# EAGLE design TG-16 (EAGLE 9.6.2)
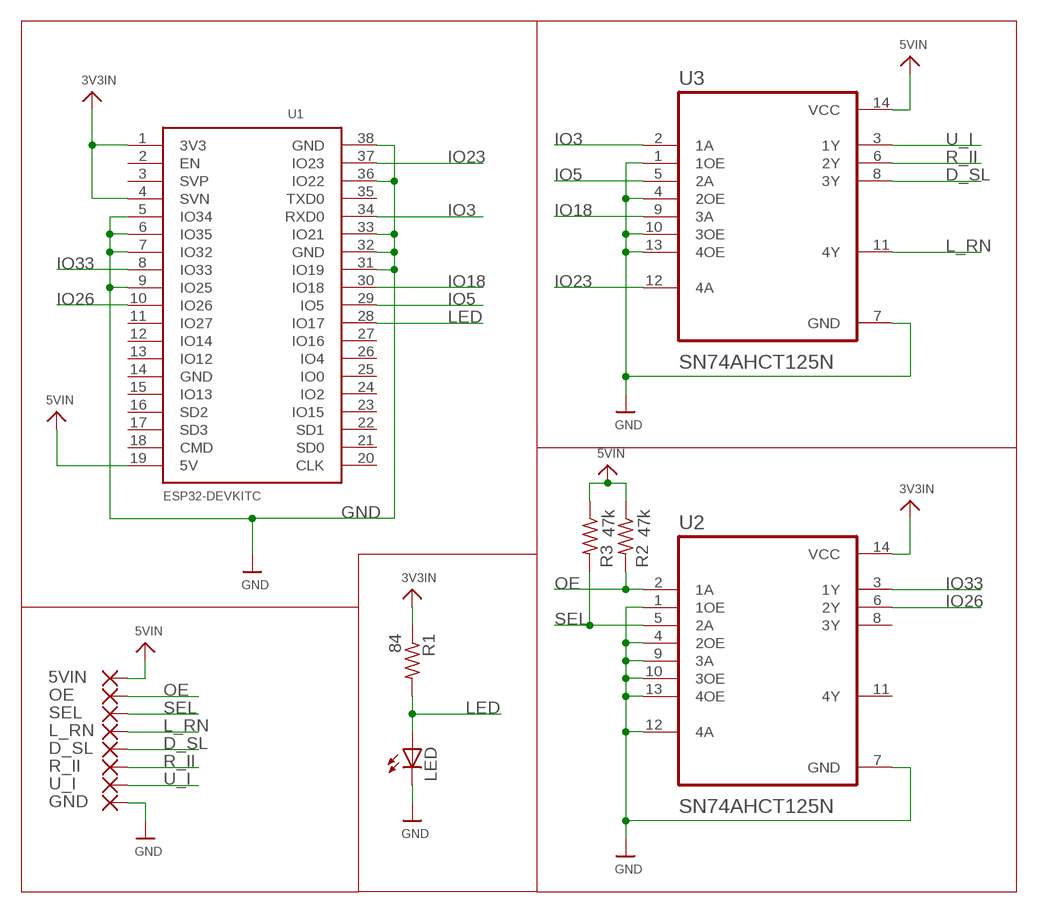
[diagram p0: schematic, sheet 1]

## Parts
5VIN  SMD5  [SMD2,54-5,08]
D_SL  SMD5  [SMD2,54-5,08]
GND  SMD5  [SMD2,54-5,08]
L_RN  SMD5  [SMD2,54-5,08]
LED  LEDCHIPLED_1206  [CHIPLED_1206]
OE  SMD5  [SMD2,54-5,08]
R1  84  R-US_R1206  [R1206]
R2  47k  R-US_R1206  [R1206]
R3  47k  R-US_R1206  [R1206]
R_II  SMD5  [SMD2,54-5,08]
SEL  SMD5  [SMD2,54-5,08]
U1  ESP32DEVKITC  [ESP32-DEVKITC]
U2  SN74AHCT125N  [DIP794W45P254L1969H508Q14]
U3  SN74AHCT125N  [DIP794W45P254L1969H508Q14]
U_I  SMD5  [SMD2,54-5,08]

## Nets
3V3IN: R1.1 U1.1(3V3) U1.4(SVN) U2.14(VCC)
5VIN: 5VIN.1(P) R2.1 R3.1 U1.19(5V) U3.14(VCC)
D_SL: D_SL.1(P) U3.8(3Y)
GND: GND.1(P) LED.C U1.5(IO34) U1.6(IO35) U1.7(IO32) U1.9(IO25) U1.31(IO19) U1.32(GND) U1.33(IO21) U1.36(IO22) U1.38(GND) U2.1(1OE) U2.4(2OE) U2.7(GND) U2.9(3A) U2.10(3OE) U2.12(4A) U2.13(4OE) U3.1(1OE) U3.4(2OE) U3.7(GND) U3.10(3OE) U3.13(4OE)
IO3: U1.34(RXD0) U3.2(1A)
IO5: U1.29(IO5) U3.5(2A)
IO18: U1.30(IO18) U3.9(3A)
IO23: U1.37(IO23) U3.12(4A)
IO26: U1.10(IO26) U2.6(2Y)
IO33: U1.8(IO33) U2.3(1Y)
L_RN: L_RN.1(P) U3.11(4Y)
LED: LED.A R1.2 U1.28(IO17)
OE: OE.1(P) R2.2 U2.2(1A)
R_II: R_II.1(P) U3.6(2Y)
SEL: R3.2 SEL.1(P) U2.5(2A)
U_I: U3.3(1Y) U_I.1(P)
Unconnected: U1.2(EN) U1.3(SVP) U1.11(IO27) U1.12(IO14) U1.13(IO12) U1.14(GND) U1.15(IO13) U1.16(SD2) U1.17(SD3) U1.18(CMD) U1.20(CLK) U1.21(SD0) U1.22(SD1) U1.23(IO15) U1.24(IO2) U1.25(IO0) U1.26(IO4) U1.27(IO16) U1.35(TXD0) U2.8(3Y) U2.11(4Y)

## Library data of the parts
5VIN D_SL GND L_RN OE R_II SEL U_I = wirepad:SMD5: SMD PAD
LED = adafruit:LED: LED OSRAM: - CHIPLED LG R971, LG N971, LY N971, LG Q971, LY Q971, LO R971, LY R971 LH N974, LH R974 LS Q976, LO Q976, LY Q976 LO Q996 - Hyper CHIPLED LW Q18S LB Q993, LB Q99A, LB R99A - SideLED LS A670, LO A670, LY A670, LG A670, LP A670 LB A673, LV A673, LT A673, LW A673 LH A674 LY A675 LS A676, LA A676, LO A676, LY A676, LW A676 LS A679, LY A679, LG A679 - Hyper Micro SIDELED® LS Y876, LA Y876, LO Y876, LY Y876 LT Y87S - SmartLED LW L88C, LW L88S LB L89C, LB L89S, LG L890 LS L89K, LO L89K, LY L89K LS L896, LA L896, LO L896, LY L896 - TOPLED LS T670, LO T670, LY T670, LG T670, LP T670 LSG T670, LSP T670, LSY T670, LOP T670, LYG T670 LG T671, LOG T671, LSG T671 LB T673, LV T673, LT T673, LW T673 LH T674 LS T676, LA T676, LO T676, LY T676, LB T676, LH T676, LSB T676, LW T676 LB T67C, LV T67C, LT T67C, LS T67K, LO T67K, LY T67K, LW E67C LS E67B, LA E67B, LO E67B, LY E67B, LB E67C, LV E67C, LT E67C LW T67C LS T679, LY T679, LG T679 LS T770, LO T770, LY T770, LG T770, LP T770 LB T773, LV T773, LT T773, LW T773 LH T774 LS E675, LA E675, LY E675, LS T675 LS T776, LA T776, LO T776, LY T776, LB T776 LHGB T686 LT T68C, LB T68C - Hyper Mini TOPLED® LB M676 - Mini TOPLED Santana® LG M470 LS M47K, LO M47K, LY M47K Source: http://www.osram.convergy.de/
R1-R3 = adafruit:R-US_: RESISTOR, American symbol
U1 = ESP32-DEVKITC:ESP32DEVKITC
U2 U3 = SN74AHCT125N:SN74AHCT125N: None Check prices <https://pricing.snapeda.com/parts/SN74AHCT125N/Texas%20Instruments/view-part?ref=eda>; AVAILABILITY: In Stock; DESCRIPTION: Quadruple Bus Buffer Gates With 3-State Outputs 14-PDIP -40 to 125; MF: Texas Instruments; MP: SN74AHCT125N; PACKAGE: PDIP-14 Texas Instruments; PRICE: None; PURCHASE-URL: https://pricing.snapeda.com/search/part/SN74AHCT125N/?ref=eda

## Board
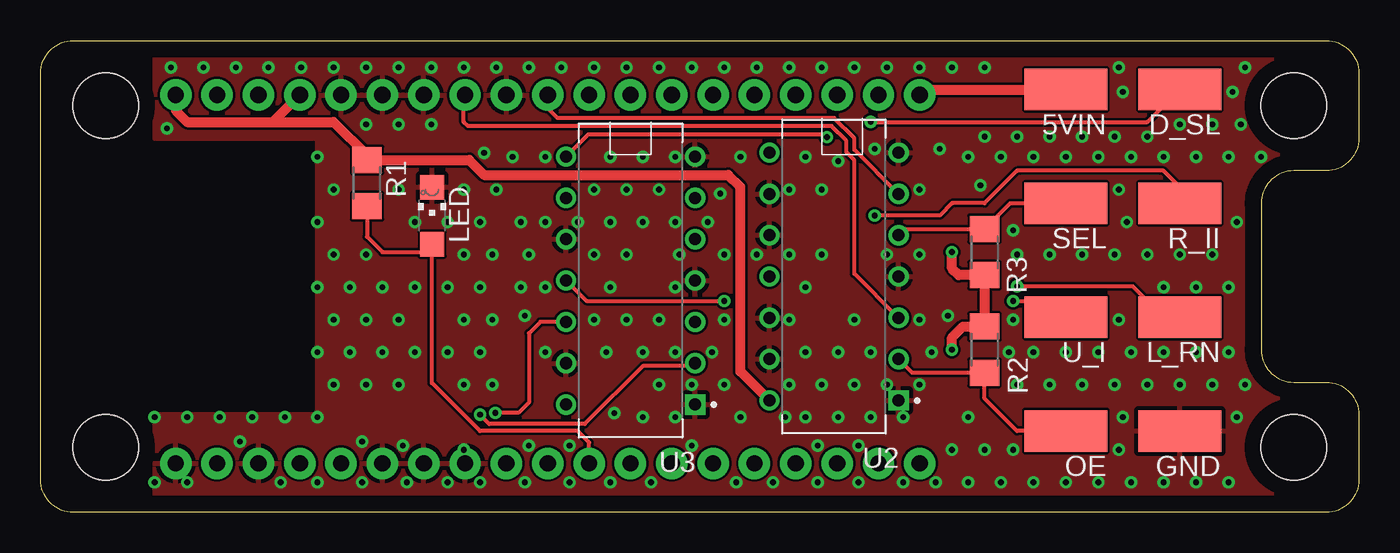
[diagram p1: board, top side]
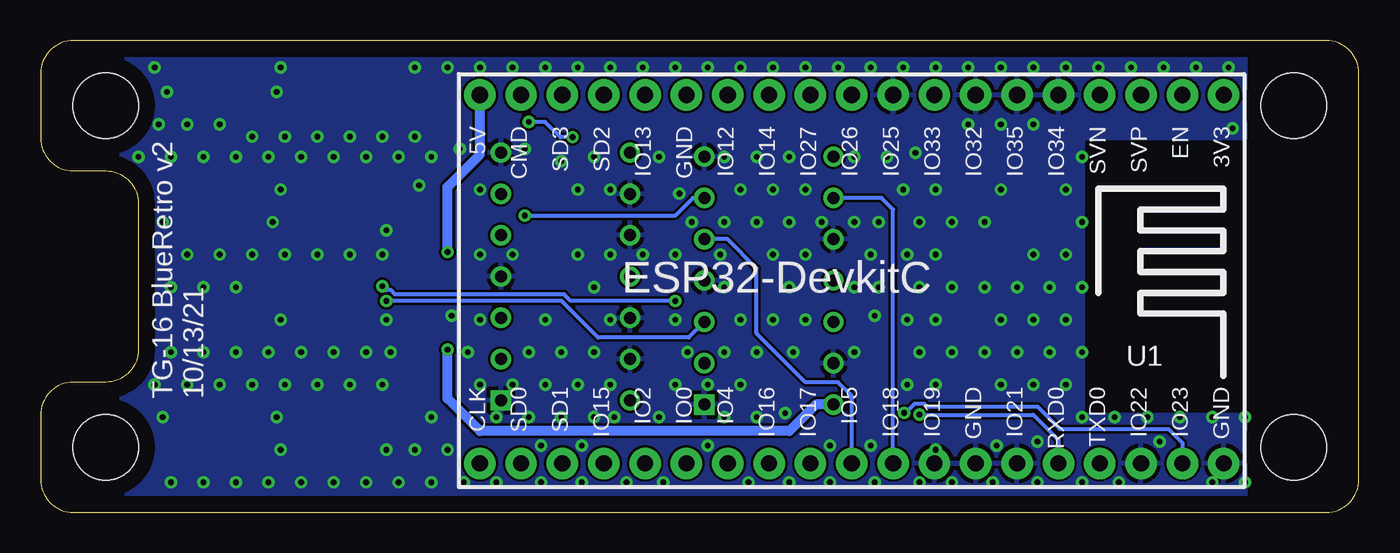
[diagram p2: board, bottom side, seen from below]

Size 81 x 29 mm. Coordinates in mm from the lower left corner, seen from the top.
Outline: 2,29 79,29 arc-90 81,27 81,23 arc-90 79,21 77,21 arc90 75,19 75,10 arc90 77,8 79,8 arc-90 81,6 81,2 arc-90 79,0 2,0 arc-90 0,2 0,27 arc-90 2,29
Copper layers (1*16): Top 0.035mm / dielectric 1.5mm / Bottom 0.035mm
Design rules "default": minimum track width 6mil, minimum drill 0.35mm, track to track 6mil, track to pad 6mil, pad to pad 6mil, via to via 6mil, smd to smd 6mil, copper to edge 40mil, drill to drill 6mil, minimum pad ring 10mil, minimum via ring 8mil, stop-mask expansion 4mil, vias tented up to drill 0.5mm, thermal gap 10mil
Holes 4 mm at 4,4 4,25 77,25 77,4

### Footprints (pad centres in the part's own frame; a part is rotated, then mirrored left to right if it is on the bottom)
SMD2,54-5,08 = smd 2.54 x 5.08: 1 0,0
CHIPLED_1206 = smd 1.5 x 1.5: A 0,-1.75; C 0,1.75
R1206 = smd 1.6 x 1.803: 1 -1.422,0; 2 1.422,0
ESP32-DEVKITC = drill 1 pad 1.93: 1 -22.87,-11.42; 2 -20.33,-11.42; 3 -17.79,-11.42; 4 -15.25,-11.42; 5 -12.71,-11.42; 6 -10.17,-11.42; 7 -7.63,-11.42; 8 -5.09,-11.42; 9 -2.55,-11.42; 10 -0.01,-11.42; 11 2.53,-11.42; 12 5.07,-11.42; 13 7.61,-11.42; 14 10.15,-11.42; 15 12.69,-11.42; 16 15.23,-11.42; 17 17.77,-11.42; 18 20.31,-11.42; 19 22.85,-11.42; 20 22.85,11.23; 21 20.31,11.23; 22 17.77,11.23; 23 15.23,11.23; 24 12.69,11.23; 25 10.15,11.23; 26 7.61,11.23; 27 5.07,11.23; 28 2.53,11.23; 29 -0.01,11.23; 30 -2.55,11.23; 31 -5.09,11.23; 32 -7.63,11.23; 33 -10.17,11.23; 34 -12.71,11.23; 35 -15.25,11.23; 36 -17.79,11.23; 37 -20.33,11.23; 38 -22.87,11.23
DIP794W45P254L1969H508Q14 = drill 0.74 pad 1.14 square: 1 -3.97,7.62 | drill 0.74 pad 1.14: 2 -3.97,5.08; 3 -3.97,2.54; 4 -3.97,0; 5 -3.97,-2.54; 6 -3.97,-5.08; 7 -3.97,-7.62; 8 3.97,-7.62; 9 3.97,-5.08; 10 3.97,-2.54; 11 3.97,0; 12 3.97,2.54; 13 3.97,5.08; 14 3.97,7.62

### Placement (x,y rotation side)
5VIN  63,26 90 top
D_SL  70,26 90 top
GND  70,5 90 top
L_RN  70,12 90 top
LED  24.05,18.24 0 top
OE  63,5 90 top
R1  20.05,20.24 270 top
R2  58,10 270 top
R3  58,16 90 top
R_II  70,19 90 top
SEL  63,19 90 top
U1  31.17,14.24 180 bottom
U2  48.75,14.5 180 top
U3  36.25,14.25 180 top
U_I  63,12 90 top

### Tracks (layer width: path | path; a pad name or v marks a point on that pad's centre or on a via)
3V3IN
  Top 0.254: 20.05,21.95 R1.1
  Top 0.61: U1.1 8.3,24.7 9,24 14.26,24 | U1.4 14.26,24 | 14.26,24 18,24 20.05,21.95 | U2.14 43,8.66 43,20 42.25,20.75 27.25,20.75 26.34,21.66 R1.1
5VIN  (via drill 0.35)
  Top 0.61: U1.19 54.36,26 5VIN.1 | v56,10 56,10.75 56.67,11.42 R2.1 R3.1 56.42,14.58 56,15 v56,16
  Bottom 0.254: 54,25.64 U1.19
  Bottom 0.61: U3.14 33.37,6.63 35,5 54,5 56,7 v56,10 | v56,16 56,20 54,22 54,25.64
D_SL  (via drill 0.35)
  Top 0.254: U3.8 33.66,23.25 48.14,23.25 v48.32,23.07 | v51,24 68,24 D_SL.1
  Bottom 0.254: v48.32,23.07 49.07,23.07 50,24 v51,24
GND  (via drill 0.35)
  other vias: 7,1.85 7,5.85 9,1.85 9,5.85 7.75,23.6 8,27.35 11,5.85 10,27.35 12.25,4.35 13,5.85 12,27.35 14.75,1.85 15,5.85 14,27.35 17,1.85 17,5.85 17,9.85 17,13.85 17,17.85 17,21.85 16,27.35 19.75,1.85 18,7.85 19,9.85 18,11.85 19,13.85 18,15.85 18,19.85 18,27.35 22.5,1.85 19.75,4.35 20,7.85 21,9.85 20,11.85 21,13.85 20,15.85 20,23.85 20,27.35 22.25,4.1 22,7.85 23,9.85 22,11.85 23,13.85 23,17.85 22,19.85 22,23.85 22,27.35 25,1.85 25,9.85 25,13.85 25,17.85 24,23.85 24,27.35 27,1.85 26,3.85 26,7.85 27,9.85 26,11.85 27,13.85 26,15.85 27,17.85 26,19.85 27.25,22.1 26,27.35 29.75,1.85 27.75,7.85 27.75,11.85 29.5,13.85 27.75,15.85 29.5,17.85 28,19.85 29,21.85 28,27.35 30,4.1 31,9.85 29.75,12.1 31,13.85 30,15.85 31,17.85 31,21.85 30,27.35 32.5,1.85 32.5,4.1 33,17.85 32,27.35 35,1.85 35.25,6.1 34.75,9.85 34,11.85 35,13.85 34,15.85 35,17.85 34,19.85 35,21.85 34,27.35 37.5,1.85 37,5.85 37,9.85 36,11.85 36,15.85 37,17.85 36,19.85 37,21.85 36,27.35 39,5.85 38,7.85 39,9.85 38,11.85 39,13.85 39,17.85 38,19.85 39,21.85 38,27.35 40,4.1 40,7.85 41.25,9.85 39.25,15.85 41,17.85 40,27.35 42.75,1.85 43,5.85 42,7.85 42,11.85 42,15.85 41.75,19.6 43,21.85 42,27.35 45,1.85 45.75,5.85 44,15.85 44,27.35 47.75,1.85 47,5.85 46,7.85 47,9.85 46,11.85 47,13.85 46,15.85 46,19.85 47,21.85 46,27.35 47.75,4.1 49,5.85 48,7.85 49,9.85 48,15.85 48,19.85 49,21.6 48,27.35 50.25,1.85 50.25,4.1 51,5.85 50,7.85 51,9.85 50,11.85 51.25,22.35 50,27.35 53,1.85 53,5.85 52,7.85 52,15.85 52,27.35 55,1.85 54,7.85 54.75,9.85 54,11.85 54,15.85 54,19.85 55.25,22.35 54,27.35 57,1.85 56,3.85 57,5.85 55.75,12.1 57,21.85 56,27.35 59,1.85 58,3.85 59.5,9.85 59.75,17.35 57.75,20.1 59,21.85 58,27.35 61,1.85 59.75,3.85 60,7.85 61,9.85 59.75,11.85 60,15.85 61,21.85 60,23.1 63,1.85 62,7.85 63,9.85 62,15.85 63,21.85 62,23.1 65,1.85 64,7.85 65,9.85 64,15.85 65,21.85 64,23.1 67,1.85 66.25,3.85 66.5,5.85 66,7.85 67,9.85 66.25,11.85 66,15.85 66.75,17.85 66.25,19.85 67,21.85 66.5,25.85 66.25,27.35 69,1.85 68,7.85 69,9.85 69,13.85 68,15.85 69,21.85 66,23.1 71,1.85 70,7.85 71,9.85 71,13.85 70,15.85 71,21.85 70,23.85 68,23.1 73,1.85 73.5,5.85 72,7.85 73,9.85 73,13.85 72,15.85 73.5,17.85 73,21.85 72,23.85 73.25,25.85 58,23.1 74,7.85 75,21.85 73.75,23.85 74,27.35
  pour Top: 7,29 7,23 17,23 17,6 7,6 7,0 81,0 81,29
  pour Bottom: 7,0 81,0 81,29 7,29 7,23 17,23 17,6 7,6
IO3  (via drill 0.35)
  Top 0.254: U3.2 40.05,9 37,9 33.43,5.43 27.57,5.43 v27,6
  Bottom 0.254: U1.34 18.46,4.46 20,6 v27,6
IO5
  Bottom 0.254: U1.29 31.16,7.16 32,8 34,8 37,11 37,15 38.79,16.79 U3.5
IO18
  Bottom 0.254: U1.30 28.62,18.62 29.33,19.33 U3.9
IO23  (via drill 0.35)
  Top 0.254: U3.12 30.71,11.71 30,11 30,6.75 29.36,6.12 v27.94,6.12
  Bottom 0.254: v27.94,6.12 27.85,6.12 27.28,6.68 26.72,6.68 26.53,6.5 19.75,6.5 18.38,5.12 11.71,5.12 10.84,4.26 U1.37
IO26
  Top 0.254: U2.6 50,22.3 50,23 48.75,24.25 31.75,24.25 31,25 31,25.5 U1.10
IO33
  Top 0.254: U2.3 50,14.68 50,21.65 49.5,22.15 49.5,22.85 48.6,23.75 26.25,23.75 26,24 26,25.58 U1.8
L_RN  (via drill 0.35)
  Top 0.254: U3.11 33.53,13 v42,13 | v60,13.91 67.09,13.91 69,12 L_RN.1
  Bottom 0.254: v42,13 48.42,13 48.83,13.41 59.23,13.41 59.48,13.66 59.75,13.66 v60,13.91
LED
  Top 0.254: U1.28 33.7,4.3 33,5 27,5 24.05,7.95 LED.A 23.56,16 21,16 20.05,16.95 R1.2
OE
  Top 0.254: OE.1 60,5 58,7 R2.2 53.56,8.58 U2.2
R_II  (via drill 0.35)
  Top 0.254: R_II.1 70,20 69,21 60,21 58,19 56,19 55.25,18.25 v51.25,18.25
  Bottom 0.254: U3.6 40.92,19.33 42,18.25 v51.25,18.25
SEL
  Top 0.254: U2.5 53.1,17.42 R3.2 59.58,19 SEL.1
U_I  (via drill 0.35)
  Top 0.254: v59.75,13 62,13 U_I.1
  Bottom 0.254: U3.3 41.18,10.75 46.75,10.75 49,13 v59.75,13

### Text on the board
bNames: TG-16 BlueRetro v2 / 10/13/21